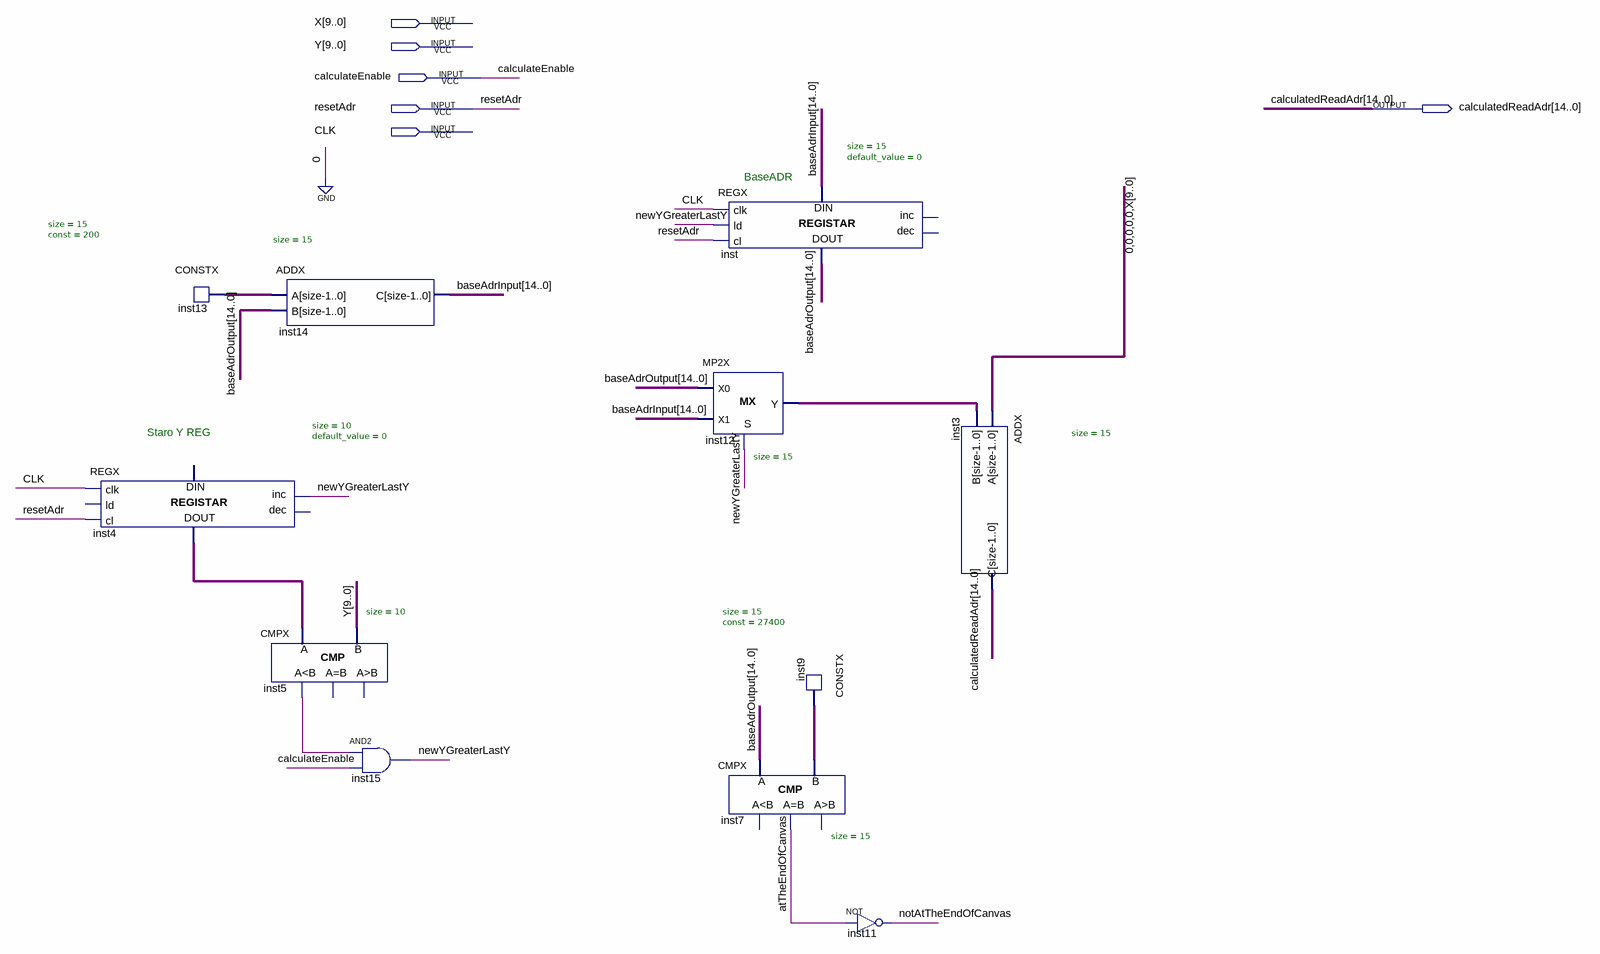
[diagram p0: schematic sheet]
// Quartus schematic CalculateReadAdr.bdf as structural Verilog: 11 symbols, 6 pins
module CalculateReadAdr (
  input  [9:0] X,
  input  [9:0] Y,
  input  calculateEnable,
  input  resetAdr,
  input  CLK,
  output [14:0] calculatedReadAdr
);

  wire atTheEndOfCanvas, inst5_ls, newYGreaterLastY, notAtTheEndOfCanvas;
  wire [9:0] inst4_data_out;
  wire [14:0] baseAdrInput, baseAdrOutput, inst9_data, inst12_y, inst13_data;

  REGX #(.size(10), .default_value(0)) inst4 (
    .clk(CLK), .cl(resetAdr), .inc(newYGreaterLastY), .data_out(inst4_data_out));  // open: ld, dec, data_in
  CONSTX #(.size(15), .\const (200)) inst13 (.data(inst13_data));
  CMPX #(.size(10)) inst5 (.A(inst4_data_out), .B(Y), .ls(inst5_ls));  // open: eq, gr
  ADDX #(.size(15)) inst14 (.A(inst13_data), .B(baseAdrOutput), .C(baseAdrInput));
  and inst15 (newYGreaterLastY, inst5_ls, calculateEnable);
  REGX #(.size(15), .default_value(0)) inst (
    .clk(CLK), .ld(newYGreaterLastY), .cl(resetAdr), .data_in(baseAdrInput), .data_out(baseAdrOutput));  // open: inc, dec
  MP2X #(.size(15)) inst12 (.S(newYGreaterLastY), .X0(baseAdrOutput), .X1(baseAdrInput), .Y(inst12_y));
  CMPX #(.size(15)) inst7 (.A(baseAdrOutput), .B(inst9_data), .eq(atTheEndOfCanvas));  // open: ls, gr
  CONSTX #(.size(15), .\const (27400)) inst9 (.data(inst9_data));
  not inst11 (notAtTheEndOfCanvas, atTheEndOfCanvas);
  ADDX #(.size(15)) inst3 (.A({{5{1'b0}}, X}), .B(inst12_y), .C(calculatedReadAdr));

  // Notes on the sheet:
  //   BaseADR
  //   Staro Y REG
endmodule
